# Altium schematic sheet POW.SchDoc
size A
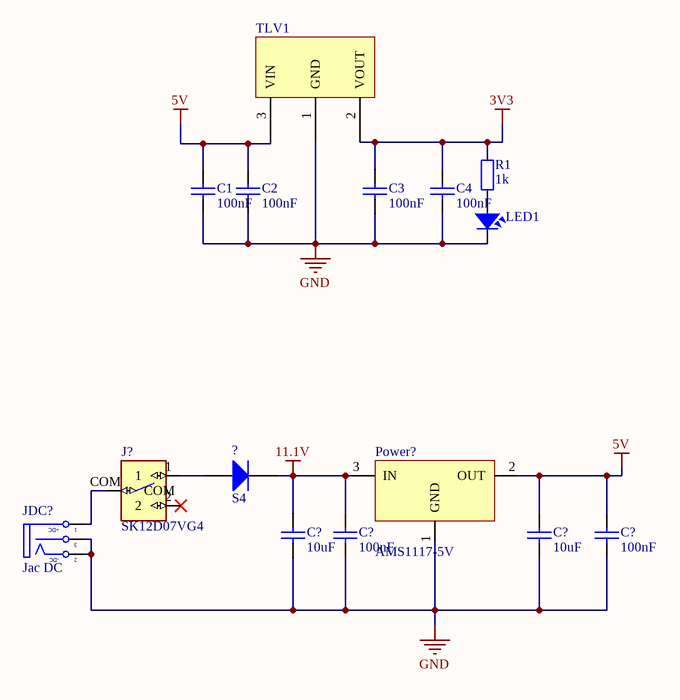
[diagram p0: POW.SchDoc]

## Parts
(Parts that share a designator on the sheet are numbered #1, #2 ... from top to bottom, then left to right.)
?  S4  [DIO-214AC(SMA)]
C1  100nF  [CAP_0805]
C2  100nF  [CAP_0805]
C3  100nF  [CAP_0805]
C4  100nF  [CAP_0805]
C?#1  10uF  [CAP_0805]
C?#2  100nF  [CAP_0805]
C?#3  10uF  [CAP_0805]
C?#4  100nF  [CAP_0805]
J?  SK12D07VG4  [SK12D07VG4]
JDC?  Jac DC  [DC-IN]
LED1  LED  [LED-0805-Blue]  (value not drawn)
Power?  AMS1117-5V  [SOT223]
R1  1k  [RES-SMD-0805]
TLV1  LM1117- 5V  [SOT230P700X180-4N]  (value not drawn)

## Nets
3V3: C3.1 C4.1 R1.1 TLV1.2(VOUT)
5V: C1.1 C2.1 C?#3.1 C?#4.1 Power?.2(OUT) TLV1.3(VIN)
11.1V: ?.2(K) C?#1.1 C?#2.1 Power?.3(IN)
GND: C1.2 C2.2 C3.2 C4.2 C?#1.2 C?#2.2 C?#3.2 C?#4.2 JDC?.2(TN) JDC?.3(S) LED1.2 Power?.1(GND) TLV1.1(GND)
Net?_1: ?.1(A) J?.1
NetJ?_COM: J?.COM JDC?.1(T)
NetLED1_1: LED1.1 R1.2

Not connected (* = marked no-connect by the designer): J? 2*

## Notes on the sheet
- (in symbol DCIN) +DC; -DC

## Library data of the parts
? = Diode S4: Dán; Ten_Linh_Kien: Diode S4 SOD123 ( 1N5819 SOD123); Ma_Hang: MH005519; Don_Vi: Con; Ghi_Chu: *; Chung_Loai: Dán; Kieu_Chan: *
C1-C4 C?#1-C?#4 = CapSMD: Capacitor; Value: 33p; Published: 8-Jun-2000; LatestRevisionDate: 17-Jul-2002; LatestRevisionNote: Re-released for DXP Platform.; PackageReference: RAD-0.3; Publisher: Altium Limited
J? = SK12D07VG4: Switch Slide ON ON SPDT Side Slide 0.3A 30VDC PC Pins Bracket Mount/Through Hole Bulk; MF: C&K; Price: None; Check_prices: https://www.snapeda.com/parts/SK12D07VG4/C&K/view-part/6618061/?ref=eda; SnapEDA_Link: https://www.snapeda.com/parts/SK12D07VG4/C&K/view-part/6618061/?ref=snap; Package: None; Availability: Not in stock; MP: SK12D07VG4; Value: *
JDC? = DCIN: Jac DC input; Value: Jac DC
LED1 = LED: LED Single colour Green and Red; Value: LED 3 ly Single Colour
Power? = LM1117: 800mA Low-Dropout Linear Regulator; Creator: Nguyen Ba Bien; Website: http://group3i.net
R1 = Resistor - SMD: Resistor; Manufacturer: Generic Components; Class: Passive; Published: 08/06/2000; Publisher: Altium Hobart Technology Centre
TLV1 = LM1117